# Altium project demo.PrjPcb
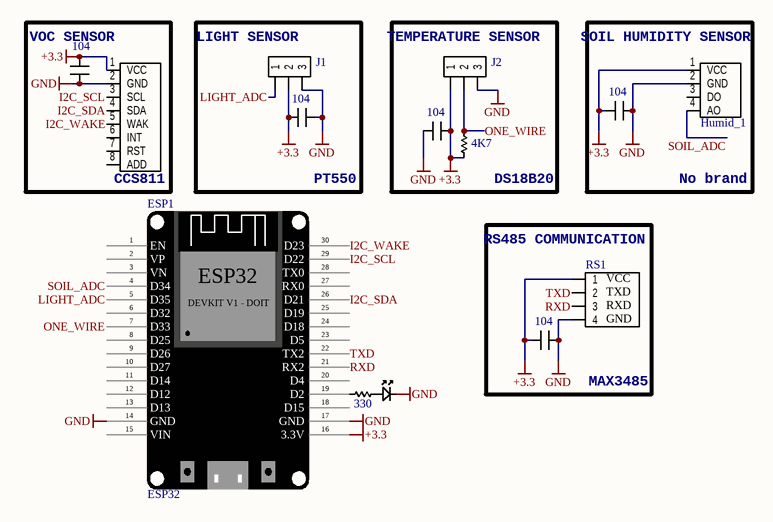
[diagram p0: Schematic.SchDoc]
CAGE_CODE: ?????; CONTRACT_NUMBER: <CONTRACT NO>; DOC_NO_ASSY_DWG: <ASSY DWG NO>; DOC_NO_BOM: <BOM DOC NO>; DOC_NO_FAB_DWG: <FAB DWG NO>; DOC_NO_SCH_DWG: <SCH DWG NO>; PCB_2_DEC_TOL: +/-.01; PCB_3_DEC_TOL: +/-.010; PCB_ANG_TOL: +/-1/2; PCB_ASSEMBLY_NO: <PCB ASSY NO>; PCB_CHECKER: - -----; PCB_CHECKER_APP_DATE: --/--/----; PCB_DESIGNER: - -----; PCB_DESIGNER_APP_DATE: --/--/----; PCB_DWG_NO: <PCB DWG NO>; PCB_ENGINEER: - -----; PCB_ENGINEER_APP_DATE: --/--/----; PCB_PART_NUMBER: <PCB PN>; PCB_REV: A; SCH_REV: A
1 sheet, 14 parts. Net scope: global (net labels, ports and power ports of the same name join across sheets).
Board file: pcb.PcbDoc

## Sheet Schematic.SchDoc
size 431 x 279 mm; SheetNumber: 1; SheetTotal: 1; ENG_APP_DATE: --/--/--; DSN_APP_DATE: --/--/--; CHK_APP_DATE: --/--/--

### Parts
C1  104  [CAP-CERAMIC-100mil]
C2  104  [CAP-CERAMIC-100mil]
C3  104  [CAP-CERAMIC-100mil]
C4  104  [CAP-CERAMIC-100mil]
C5  104  [CAP-CERAMIC-100mil]
CCS1  CCS811_HDC1080  [CSS811-MODULE-TER-J8x1-F-2.54mm]  (value not drawn)
ESP1  ESP32  [2#ESP32_DEVKIT_V1]
Humid_1  Soil Humidity Sensor  [SOIL_HUMID_TER-J4x1-F-2.54mm]  (value not drawn)
J1  Header  [TER-J3x1-M-2.54mm]  (value not drawn)
J2  Header  [TER-J3x1-M-2.54mm]  (value not drawn)
LED1  LED  [TER-H2]  (value not drawn)
R1  4K7  [RES-HOLE-1/8W]
R2  330  [RES-HOLE-1/8W]
RS1  RS485-Module  [5#RS485 to TTL - SIMPLIFIED]  (value not drawn)

### Nets
+3.3: C1.2 C2.1 C3.1 C4.2 C5.1 CCS1.1(VCC) ESP1.16(3.3V) Humid_1.1(VCC) J1.2 J2.1 R1.1 RS1.1
GND: C1.1 C2.2 C3.2 C4.1 C5.2 CCS1.2(GND) ESP1.14(GND) ESP1.17(GND) Humid_1.2(GND) J1.3 J2.3 LED1.2(K) RS1.4
I2C_SCL: CCS1.3(SCL) ESP1.29(D22)
I2C_SDA: CCS1.4(SDA) ESP1.26(D21)
I2C_WAKE: CCS1.5(WAK) ESP1.30(D23)
LIGHT_ADC: ESP1.5(D35) J1.1
ONE_WIRE: ESP1.7(D33) J2.2 R1.2
RXD: ESP1.21(RX2) RS1.3
SOIL_ADC: ESP1.4(D34) Humid_1.4(AO)
TXD: ESP1.22(TX2) RS1.2
NetESP1_19: ESP1.19(D2) R2.2
NetLED1_1: LED1.1(A) R2.1

Not connected (* = marked no-connect by the designer): CCS1 6(INT) 7(RST) 8(ADD); ESP1 1(EN) 2(VP) 3(VN) 6(D32) 8(D25) 9(D26) 10(D27) 11(D14) 12(D12) 13(D13) 15(VIN) 18(D15) 20(D4) 23(D5) 24(D18) 25(D19) 27(RX0) 28(TX0); Humid_1 3(DO)

### Notes on the sheet
- VOC SENSOR
- (near J1) LIGHT SENSOR
- (near J2) TEMPERATURE SENSOR
- (near Humid_1) SOIL HUMIDITY SENSOR
- (near CCS1) CCS811
- PT550
- (near R1) DS18B20
- No brand
- (near RS1) RS485 COMMUNICATION
- MAX3485
- 8
- 7
- 6
- 5
- 4
- 3
- DWG. NO.
- REV.
- SHT.
- 2
- 1
- THIS DOCUMENT AND THE DATA DISCLOSED HEREIN OR HEREWITH IS THE PROPERTY OF ALTIUM LIMITED AND MAY BE FREELY DISTRIBUTED IN WHOLE. NO RIGHTS ARE RESERVED OR EXPRESS OR IMPLIED WARANTEE GIVEN.
- REVISION
- DESCRIPTION
- DATE
- APPROVED
- F
- E
- D
- C
- B
- ENG:
- APPROVALS
- PROJECT
- SUITE 200
- 2175 SALK AVENUE
- CARLSBAD, CA 92008
- A
- DSN:
- CHK:
- REFERENCE DOCUMENTS
- PROJECT REVISION:
- TITLE
- DOCUMENT REVISION:
- DESIGN ITEM:
- USA
- BOM:
- FAB DWG:
- PCB DWG:
- ASSY DWG:
- SCALE:
- SIZE
- CAGE CODE
- FILE NAME
- DWG NO.
- SHEET
- OF
- REV
- (in symbol 2#B#ESP32_DOIT_DEVKIT_V1) DEVKIT V1 - DOIT
- (in symbol 5#RS485 to TTL - simplified) VCC; TXD; RXD; GND

### Library data of the parts
C1-C5 = CMP-003-000000-1: Capacitor; Source: Library.SchLib; Design Item ID: CAP
CCS1 = CCS811_HDC1080: https://www.thegioiic.com/products/ccs811-mach-cam-bien-khi-co-chat-luong-khong-khi
ESP1 = 2#B#ESP32_DOIT_DEVKIT_V1
Humid_1 = Soil Humidity Sensor: https://www.thegioiic.com/products/cam-bien-do-am-dat-dau-do-chong-an-mon
J1 J2 = CMP-004-000002-1: Design Item ID: Header 3x1; Source: Library.SchLib
LED1 = CMP-009-000000-2: Light Emitting Diode; Code - JEDEC: DO-214-AB; Design Item ID: LED; Published: 8-Jun-2000; Publisher: Altium Limited; Source: Library.SchLib; Revision: July-2002: Re-released for DXP Platform.
R1 R2 = CMP-011-000003-1: Resistor; Class: Passive; SubClass: R; Published: 08/06/2021; Design Item ID: RES; Source: Library.SchLib
RS1 = 5#RS485 to TTL - simplified: https://www.thegioiic.com/products/mach-chuyen-doi-rs485-to-ttl